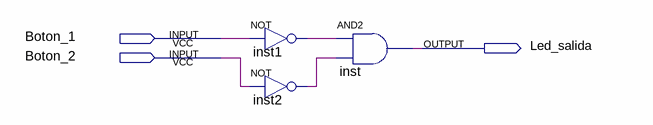
[diagram p0: schematic sheet]
// Quartus schematic DemoAnd2_sch.bdf as structural Verilog: 3 symbols, 3 pins
module DemoAnd2_sch (
  input  Boton_1,
  input  Boton_2,
  output Led_salida
);

  wire inst1_out, inst2_out;

  not inst1 (inst1_out, Boton_1);
  not inst2 (inst2_out, Boton_2);
  and inst (Led_salida, inst1_out, inst2_out);
endmodule
